# Altium schematic sheet 红外接收模块.SchDoc
size A4
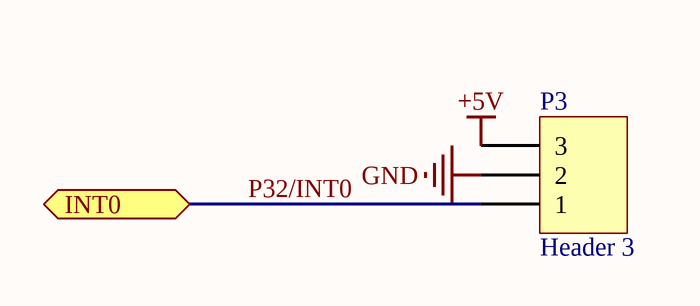
[diagram p0: 红外接收模块.SchDoc]

## Parts
P3  Header 3  [HDR1X3]

## Ports
INT0 (bidir)

## Nets
+5V: P3.3
GND: P3.2
P32/INT0: P3.1 ; port INT0

## Notes on the sheet
- 专升本
- 通信工程
- 李烨攀
- 2101班
- 210806300163
- 学号

## Library data of the parts
P3 = Header 3: Header, 3-Pin; LatestRevisionDate: 17-Jul-2002; LatestRevisionNote: Re-released for DXP Platform.; Publisher: Altium Limited